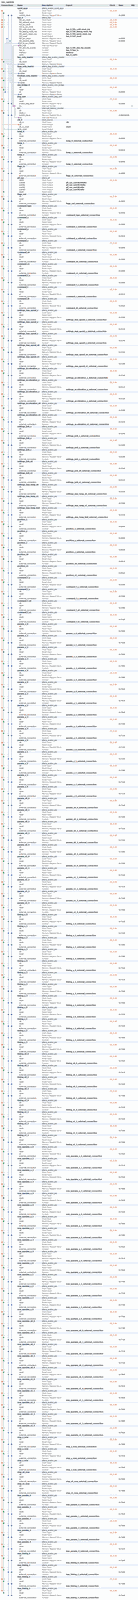
[diagram p0: system contents, whole]
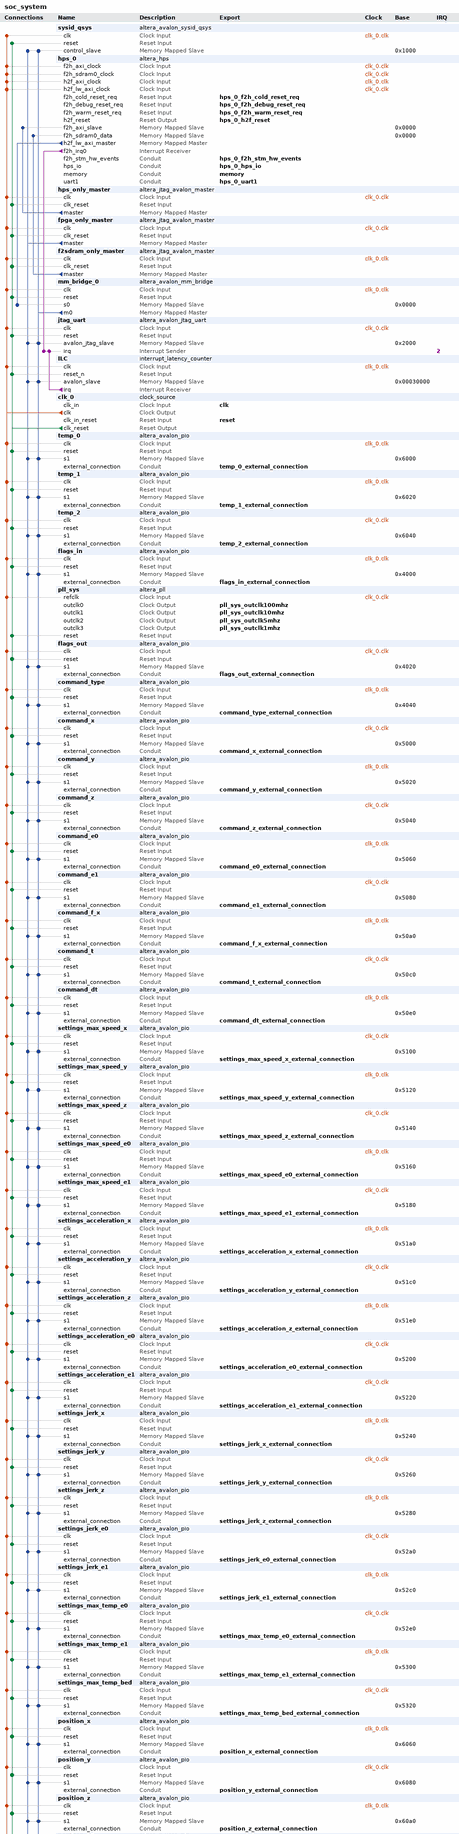
[diagram p1: system contents, upper part]
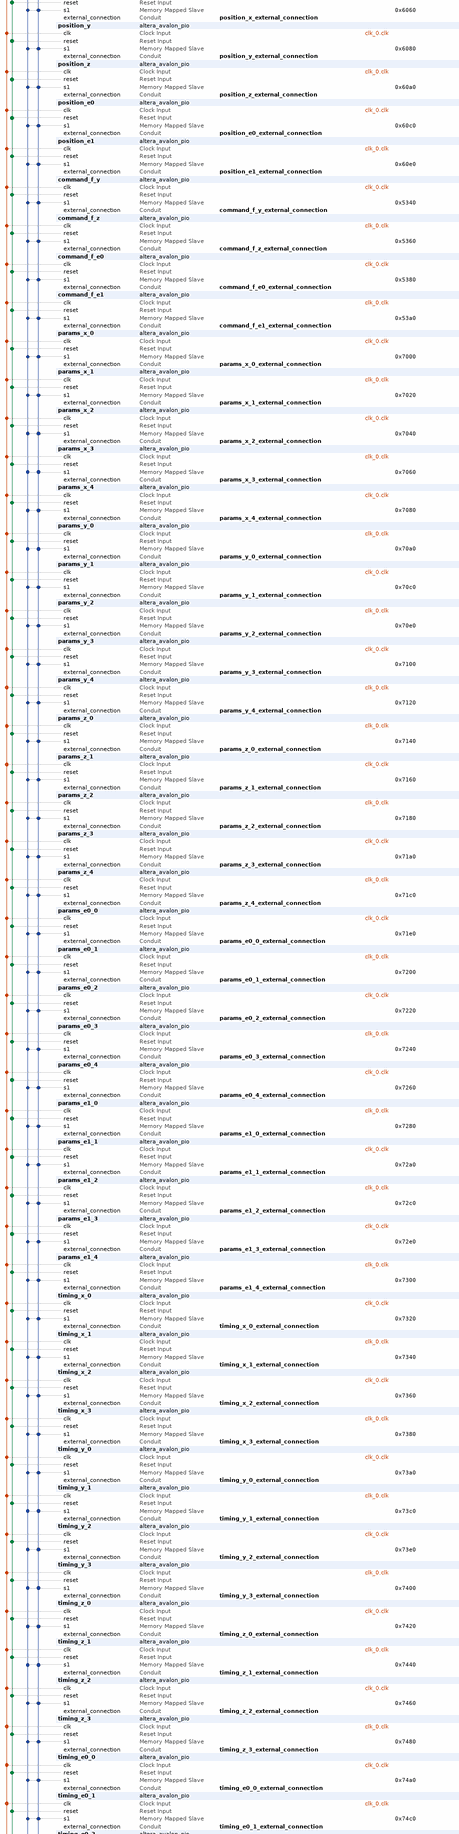
[diagram p2: system contents, middle part]
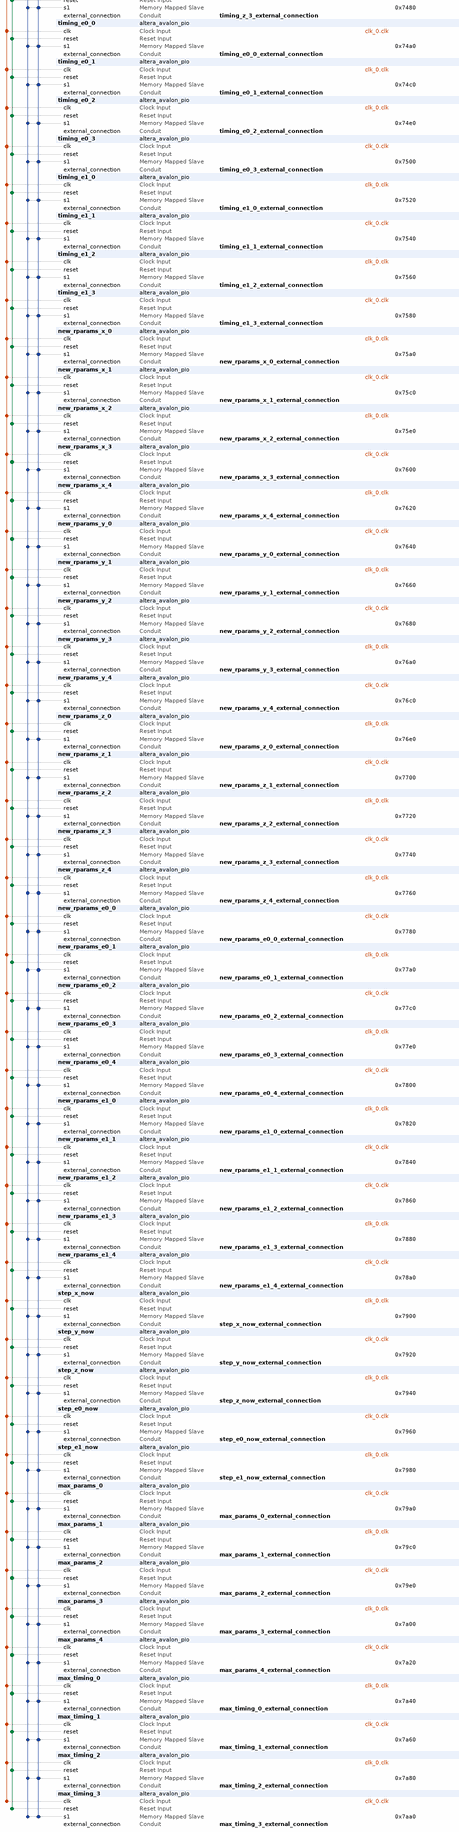
[diagram p3: system contents, lower part]
# Platform Designer (Qsys) system soc_system, Cyclone V 5CSEBA6U23I7
# Parameters at their usual value, and those the tool derives, are not listed.
package require -exact qsys 18.1
create_system soc_system
set_project_property DEVICE_FAMILY {Cyclone V}
set_project_property DEVICE 5CSEBA6U23I7

add_instance sysid_qsys altera_avalon_sysid_qsys 18.1
set_instance_parameter_value sysid_qsys id -60670

add_instance hps_0 altera_hps 18.1
set_instance_parameter_value hps_0 EMAC1_Mode RGMII
set_instance_parameter_value hps_0 EMAC1_PinMuxing {HPS I/O Set 0}
set_instance_parameter_value hps_0 F2SCLK_COLDRST_Enable true
set_instance_parameter_value hps_0 F2SCLK_DBGRST_Enable true
set_instance_parameter_value hps_0 F2SCLK_WARMRST_Enable true
set_instance_parameter_value hps_0 F2SDRAM_Type {Avalon-MM Bidirectional}
set_instance_parameter_value hps_0 F2SDRAM_Width 256
set_instance_parameter_value hps_0 F2SINTERRUPT_Enable true
set_instance_parameter_value hps_0 F2S_Width 2
set_instance_parameter_value hps_0 FPGA_PERIPHERAL_OUTPUT_CLOCK_FREQ_EMAC0_GTX_CLK 100
set_instance_parameter_value hps_0 FPGA_PERIPHERAL_OUTPUT_CLOCK_FREQ_EMAC0_MD_CLK 100.0
set_instance_parameter_value hps_0 FPGA_PERIPHERAL_OUTPUT_CLOCK_FREQ_EMAC1_GTX_CLK 100
set_instance_parameter_value hps_0 FPGA_PERIPHERAL_OUTPUT_CLOCK_FREQ_EMAC1_MD_CLK 100.0
set_instance_parameter_value hps_0 HPS_PROTOCOL DDR3
set_instance_parameter_value hps_0 I2C0_Mode I2C
set_instance_parameter_value hps_0 I2C0_PinMuxing {HPS I/O Set 0}
set_instance_parameter_value hps_0 I2C1_Mode I2C
set_instance_parameter_value hps_0 I2C1_PinMuxing {HPS I/O Set 0}
set_instance_parameter_value hps_0 LWH2F_Enable true
set_instance_parameter_value hps_0 MEM_BANKADDR_WIDTH 3
set_instance_parameter_value hps_0 MEM_CLK_FREQ 400.0
set_instance_parameter_value hps_0 MEM_COL_ADDR_WIDTH 10
set_instance_parameter_value hps_0 MEM_DQ_WIDTH 32
set_instance_parameter_value hps_0 MEM_DRV_STR RZQ/6
set_instance_parameter_value hps_0 MEM_ROW_ADDR_WIDTH 15
set_instance_parameter_value hps_0 MEM_RTT_NOM RZQ/6
set_instance_parameter_value hps_0 MEM_RTT_WR {Dynamic ODT off}
set_instance_parameter_value hps_0 MEM_TCL 7
set_instance_parameter_value hps_0 MEM_TFAW_NS 37.5
set_instance_parameter_value hps_0 MEM_TRAS_NS 35.0
set_instance_parameter_value hps_0 MEM_TRCD_NS 13.75
set_instance_parameter_value hps_0 MEM_TRFC_NS 300.0
set_instance_parameter_value hps_0 MEM_TRP_NS 13.75
set_instance_parameter_value hps_0 MEM_VENDOR Other
set_instance_parameter_value hps_0 MEM_WTCL 7
set_instance_parameter_value hps_0 QSPI_Mode N/A
set_instance_parameter_value hps_0 QSPI_PinMuxing Unused
set_instance_parameter_value hps_0 REF_CLK_FREQ 25.0
set_instance_parameter_value hps_0 S2FCLK_USER2CLK 4
set_instance_parameter_value hps_0 S2F_Width 2
set_instance_parameter_value hps_0 SDIO_Mode {4-bit Data}
set_instance_parameter_value hps_0 SDIO_PinMuxing {HPS I/O Set 0}
set_instance_parameter_value hps_0 SPIM1_Mode {Single Slave Select}
set_instance_parameter_value hps_0 SPIM1_PinMuxing {HPS I/O Set 0}
set_instance_parameter_value hps_0 STM_Enable true
set_instance_parameter_value hps_0 TIMING_BOARD_AC_SKEW 0.02
set_instance_parameter_value hps_0 TIMING_BOARD_AC_TO_CK_SKEW 0.0
set_instance_parameter_value hps_0 TIMING_BOARD_DQ_TO_DQS_SKEW 0.0
set_instance_parameter_value hps_0 TIMING_BOARD_MAX_CK_DELAY 0.6
set_instance_parameter_value hps_0 TIMING_BOARD_MAX_DQS_DELAY 0.6
set_instance_parameter_value hps_0 TIMING_BOARD_SKEW_BETWEEN_DQS 0.02
set_instance_parameter_value hps_0 TIMING_BOARD_SKEW_CKDQS_DIMM_MAX 0.01
set_instance_parameter_value hps_0 TIMING_BOARD_SKEW_CKDQS_DIMM_MIN -0.01
set_instance_parameter_value hps_0 TIMING_BOARD_SKEW_WITHIN_DQS 0.02
set_instance_parameter_value hps_0 TIMING_TDH 125
set_instance_parameter_value hps_0 TIMING_TDQSCK 400
set_instance_parameter_value hps_0 TIMING_TDQSQ 120
set_instance_parameter_value hps_0 TIMING_TDS 50
set_instance_parameter_value hps_0 TIMING_TIH 250
set_instance_parameter_value hps_0 TIMING_TIS 175
set_instance_parameter_value hps_0 TIMING_TQSH 0.38
set_instance_parameter_value hps_0 UART0_Mode {No Flow Control}
set_instance_parameter_value hps_0 UART0_PinMuxing {HPS I/O Set 0}
set_instance_parameter_value hps_0 UART1_Mode Full
set_instance_parameter_value hps_0 UART1_PinMuxing FPGA
set_instance_parameter_value hps_0 USB1_Mode SDR
set_instance_parameter_value hps_0 USB1_PinMuxing {HPS I/O Set 0}
set_instance_parameter_value hps_0 desired_cfg_clk_mhz 100.0
set_instance_parameter_value hps_0 desired_qspi_clk_mhz 370.0

add_instance hps_only_master altera_jtag_avalon_master 18.1

add_instance fpga_only_master altera_jtag_avalon_master 18.1

add_instance f2sdram_only_master altera_jtag_avalon_master 18.1

add_instance mm_bridge_0 altera_avalon_mm_bridge 18.1
set_instance_parameter_value mm_bridge_0 ADDRESS_UNITS SYMBOLS
set_instance_parameter_value mm_bridge_0 ADDRESS_WIDTH 10
set_instance_parameter_value mm_bridge_0 DATA_WIDTH 32
set_instance_parameter_value mm_bridge_0 MAX_PENDING_RESPONSES 4
set_instance_parameter_value mm_bridge_0 USE_AUTO_ADDRESS_WIDTH 1

add_instance jtag_uart altera_avalon_jtag_uart 18.1
set_instance_parameter_value jtag_uart allowMultipleConnections true
set_instance_parameter_value jtag_uart simInteractiveOptions INTERACTIVE_ASCII_OUTPUT

add_instance ILC interrupt_latency_counter 18.1

add_instance clk_0 clock_source 18.1
set_instance_parameter_value clk_0 clockFrequency 50000000

add_instance temp_0 altera_avalon_pio 18.1
set_instance_parameter_value temp_0 direction Input
set_instance_parameter_value temp_0 width 12

add_instance temp_1 altera_avalon_pio 18.1
set_instance_parameter_value temp_1 direction Input
set_instance_parameter_value temp_1 width 12

add_instance temp_2 altera_avalon_pio 18.1
set_instance_parameter_value temp_2 direction Input
set_instance_parameter_value temp_2 width 12

add_instance flags_in altera_avalon_pio 18.1
set_instance_parameter_value flags_in direction Input
set_instance_parameter_value flags_in width 32

add_instance pll_sys altera_pll 18.1
set_instance_parameter_value pll_sys gui_device_speed_grade 2
set_instance_parameter_value pll_sys gui_number_of_clocks 4
set_instance_parameter_value pll_sys gui_operation_mode direct
set_instance_parameter_value pll_sys gui_output_clock_frequency0 100.0
set_instance_parameter_value pll_sys gui_output_clock_frequency1 10.0
set_instance_parameter_value pll_sys gui_output_clock_frequency2 5.0
set_instance_parameter_value pll_sys gui_output_clock_frequency3 1.0
set_instance_parameter_value pll_sys gui_pll_mode {Integer-N PLL}
set_instance_parameter_value pll_sys gui_reference_clock_frequency 50.0
set_instance_parameter_value pll_sys gui_use_locked false

add_instance flags_out altera_avalon_pio 18.1
set_instance_parameter_value flags_out direction Output
set_instance_parameter_value flags_out width 32

add_instance command_type altera_avalon_pio 18.1
set_instance_parameter_value command_type direction Output
set_instance_parameter_value command_type width 32

add_instance command_x altera_avalon_pio 18.1
set_instance_parameter_value command_x direction Output
set_instance_parameter_value command_x width 32

add_instance command_y altera_avalon_pio 18.1
set_instance_parameter_value command_y direction Output
set_instance_parameter_value command_y width 32

add_instance command_z altera_avalon_pio 18.1
set_instance_parameter_value command_z direction Output
set_instance_parameter_value command_z width 32

add_instance command_e0 altera_avalon_pio 18.1
set_instance_parameter_value command_e0 direction Output
set_instance_parameter_value command_e0 width 32

add_instance command_e1 altera_avalon_pio 18.1
set_instance_parameter_value command_e1 direction Output
set_instance_parameter_value command_e1 width 32

add_instance command_f_x altera_avalon_pio 18.1
set_instance_parameter_value command_f_x direction Output
set_instance_parameter_value command_f_x width 32

add_instance command_t altera_avalon_pio 18.1
set_instance_parameter_value command_t direction Output
set_instance_parameter_value command_t width 12

add_instance command_dt altera_avalon_pio 18.1
set_instance_parameter_value command_dt direction Output
set_instance_parameter_value command_dt width 12

add_instance settings_max_speed_x altera_avalon_pio 18.1
set_instance_parameter_value settings_max_speed_x direction Output
set_instance_parameter_value settings_max_speed_x width 32

add_instance settings_max_speed_y altera_avalon_pio 18.1
set_instance_parameter_value settings_max_speed_y direction Output
set_instance_parameter_value settings_max_speed_y width 32

add_instance settings_max_speed_z altera_avalon_pio 18.1
set_instance_parameter_value settings_max_speed_z direction Output
set_instance_parameter_value settings_max_speed_z width 32

add_instance settings_max_speed_e0 altera_avalon_pio 18.1
set_instance_parameter_value settings_max_speed_e0 direction Output
set_instance_parameter_value settings_max_speed_e0 width 32

add_instance settings_max_speed_e1 altera_avalon_pio 18.1
set_instance_parameter_value settings_max_speed_e1 direction Output
set_instance_parameter_value settings_max_speed_e1 width 32

add_instance settings_acceleration_x altera_avalon_pio 18.1
set_instance_parameter_value settings_acceleration_x direction Output
set_instance_parameter_value settings_acceleration_x width 32

add_instance settings_acceleration_y altera_avalon_pio 18.1
set_instance_parameter_value settings_acceleration_y direction Output
set_instance_parameter_value settings_acceleration_y width 32

add_instance settings_acceleration_z altera_avalon_pio 18.1
set_instance_parameter_value settings_acceleration_z direction Output
set_instance_parameter_value settings_acceleration_z width 32

add_instance settings_acceleration_e0 altera_avalon_pio 18.1
set_instance_parameter_value settings_acceleration_e0 direction Output
set_instance_parameter_value settings_acceleration_e0 width 32

add_instance settings_acceleration_e1 altera_avalon_pio 18.1
set_instance_parameter_value settings_acceleration_e1 direction Output
set_instance_parameter_value settings_acceleration_e1 width 32

add_instance settings_jerk_x altera_avalon_pio 18.1
set_instance_parameter_value settings_jerk_x direction Output
set_instance_parameter_value settings_jerk_x width 32

add_instance settings_jerk_y altera_avalon_pio 18.1
set_instance_parameter_value settings_jerk_y direction Output
set_instance_parameter_value settings_jerk_y width 32

add_instance settings_jerk_z altera_avalon_pio 18.1
set_instance_parameter_value settings_jerk_z direction Output
set_instance_parameter_value settings_jerk_z width 32

add_instance settings_jerk_e0 altera_avalon_pio 18.1
set_instance_parameter_value settings_jerk_e0 direction Output
set_instance_parameter_value settings_jerk_e0 width 32

add_instance settings_jerk_e1 altera_avalon_pio 18.1
set_instance_parameter_value settings_jerk_e1 direction Output
set_instance_parameter_value settings_jerk_e1 width 32

add_instance settings_max_temp_e0 altera_avalon_pio 18.1
set_instance_parameter_value settings_max_temp_e0 direction Output
set_instance_parameter_value settings_max_temp_e0 width 12

add_instance settings_max_temp_e1 altera_avalon_pio 18.1
set_instance_parameter_value settings_max_temp_e1 direction Output
set_instance_parameter_value settings_max_temp_e1 width 12

add_instance settings_max_temp_bed altera_avalon_pio 18.1
set_instance_parameter_value settings_max_temp_bed direction Output
set_instance_parameter_value settings_max_temp_bed width 12

add_instance position_x altera_avalon_pio 18.1
set_instance_parameter_value position_x direction Input
set_instance_parameter_value position_x width 32

add_instance position_y altera_avalon_pio 18.1
set_instance_parameter_value position_y direction Input
set_instance_parameter_value position_y width 32

add_instance position_z altera_avalon_pio 18.1
set_instance_parameter_value position_z direction Input
set_instance_parameter_value position_z width 32

add_instance position_e0 altera_avalon_pio 18.1
set_instance_parameter_value position_e0 direction Input
set_instance_parameter_value position_e0 width 32

add_instance position_e1 altera_avalon_pio 18.1
set_instance_parameter_value position_e1 direction Input
set_instance_parameter_value position_e1 width 32

add_instance command_f_y altera_avalon_pio 18.1
set_instance_parameter_value command_f_y direction Output
set_instance_parameter_value command_f_y width 32

add_instance command_f_z altera_avalon_pio 18.1
set_instance_parameter_value command_f_z direction Output
set_instance_parameter_value command_f_z width 32

add_instance command_f_e0 altera_avalon_pio 18.1
set_instance_parameter_value command_f_e0 direction Output
set_instance_parameter_value command_f_e0 width 32

add_instance command_f_e1 altera_avalon_pio 18.1
set_instance_parameter_value command_f_e1 direction Output
set_instance_parameter_value command_f_e1 width 32

add_instance params_x_0 altera_avalon_pio 18.1
set_instance_parameter_value params_x_0 direction Input
set_instance_parameter_value params_x_0 width 32

add_instance params_x_1 altera_avalon_pio 18.1
set_instance_parameter_value params_x_1 direction Input
set_instance_parameter_value params_x_1 width 32

add_instance params_x_2 altera_avalon_pio 18.1
set_instance_parameter_value params_x_2 direction Input
set_instance_parameter_value params_x_2 width 32

add_instance params_x_3 altera_avalon_pio 18.1
set_instance_parameter_value params_x_3 direction Input
set_instance_parameter_value params_x_3 width 32

add_instance params_x_4 altera_avalon_pio 18.1
set_instance_parameter_value params_x_4 direction Input
set_instance_parameter_value params_x_4 width 32

add_instance params_y_0 altera_avalon_pio 18.1
set_instance_parameter_value params_y_0 direction Input
set_instance_parameter_value params_y_0 width 32

add_instance params_y_1 altera_avalon_pio 18.1
set_instance_parameter_value params_y_1 direction Input
set_instance_parameter_value params_y_1 width 32

add_instance params_y_2 altera_avalon_pio 18.1
set_instance_parameter_value params_y_2 direction Input
set_instance_parameter_value params_y_2 width 32

add_instance params_y_3 altera_avalon_pio 18.1
set_instance_parameter_value params_y_3 direction Input
set_instance_parameter_value params_y_3 width 32

add_instance params_y_4 altera_avalon_pio 18.1
set_instance_parameter_value params_y_4 direction Input
set_instance_parameter_value params_y_4 width 32

add_instance params_z_0 altera_avalon_pio 18.1
set_instance_parameter_value params_z_0 direction Input
set_instance_parameter_value params_z_0 width 32

add_instance params_z_1 altera_avalon_pio 18.1
set_instance_parameter_value params_z_1 direction Input
set_instance_parameter_value params_z_1 width 32

add_instance params_z_2 altera_avalon_pio 18.1
set_instance_parameter_value params_z_2 direction Input
set_instance_parameter_value params_z_2 width 32

add_instance params_z_3 altera_avalon_pio 18.1
set_instance_parameter_value params_z_3 direction Input
set_instance_parameter_value params_z_3 width 32

add_instance params_z_4 altera_avalon_pio 18.1
set_instance_parameter_value params_z_4 direction Input
set_instance_parameter_value params_z_4 width 32

add_instance params_e0_0 altera_avalon_pio 18.1
set_instance_parameter_value params_e0_0 direction Input
set_instance_parameter_value params_e0_0 width 32

add_instance params_e0_1 altera_avalon_pio 18.1
set_instance_parameter_value params_e0_1 direction Input
set_instance_parameter_value params_e0_1 width 32

add_instance params_e0_2 altera_avalon_pio 18.1
set_instance_parameter_value params_e0_2 direction Input
set_instance_parameter_value params_e0_2 width 32

add_instance params_e0_3 altera_avalon_pio 18.1
set_instance_parameter_value params_e0_3 direction Input
set_instance_parameter_value params_e0_3 width 32

add_instance params_e0_4 altera_avalon_pio 18.1
set_instance_parameter_value params_e0_4 direction Input
set_instance_parameter_value params_e0_4 width 32

add_instance params_e1_0 altera_avalon_pio 18.1
set_instance_parameter_value params_e1_0 direction Input
set_instance_parameter_value params_e1_0 width 32

add_instance params_e1_1 altera_avalon_pio 18.1
set_instance_parameter_value params_e1_1 direction Input
set_instance_parameter_value params_e1_1 width 32

add_instance params_e1_2 altera_avalon_pio 18.1
set_instance_parameter_value params_e1_2 direction Input
set_instance_parameter_value params_e1_2 width 32

add_instance params_e1_3 altera_avalon_pio 18.1
set_instance_parameter_value params_e1_3 direction Input
set_instance_parameter_value params_e1_3 width 32

add_instance params_e1_4 altera_avalon_pio 18.1
set_instance_parameter_value params_e1_4 direction Input
set_instance_parameter_value params_e1_4 width 32

add_instance timing_x_0 altera_avalon_pio 18.1
set_instance_parameter_value timing_x_0 direction Input
set_instance_parameter_value timing_x_0 width 32

add_instance timing_x_1 altera_avalon_pio 18.1
set_instance_parameter_value timing_x_1 direction Input
set_instance_parameter_value timing_x_1 width 32

add_instance timing_x_2 altera_avalon_pio 18.1
set_instance_parameter_value timing_x_2 direction Input
set_instance_parameter_value timing_x_2 width 32

add_instance timing_x_3 altera_avalon_pio 18.1
set_instance_parameter_value timing_x_3 direction Input
set_instance_parameter_value timing_x_3 width 32

add_instance timing_y_0 altera_avalon_pio 18.1
set_instance_parameter_value timing_y_0 direction Input
set_instance_parameter_value timing_y_0 width 32

add_instance timing_y_1 altera_avalon_pio 18.1
set_instance_parameter_value timing_y_1 direction Input
set_instance_parameter_value timing_y_1 width 32

add_instance timing_y_2 altera_avalon_pio 18.1
set_instance_parameter_value timing_y_2 direction Input
set_instance_parameter_value timing_y_2 width 32

add_instance timing_y_3 altera_avalon_pio 18.1
set_instance_parameter_value timing_y_3 direction Input
set_instance_parameter_value timing_y_3 width 32

add_instance timing_z_0 altera_avalon_pio 18.1
set_instance_parameter_value timing_z_0 direction Input
set_instance_parameter_value timing_z_0 width 32

add_instance timing_z_1 altera_avalon_pio 18.1
set_instance_parameter_value timing_z_1 direction Input
set_instance_parameter_value timing_z_1 width 32

add_instance timing_z_2 altera_avalon_pio 18.1
set_instance_parameter_value timing_z_2 direction Input
set_instance_parameter_value timing_z_2 width 32

add_instance timing_z_3 altera_avalon_pio 18.1
set_instance_parameter_value timing_z_3 direction Input
set_instance_parameter_value timing_z_3 width 32

add_instance timing_e0_0 altera_avalon_pio 18.1
set_instance_parameter_value timing_e0_0 direction Input
set_instance_parameter_value timing_e0_0 width 32

add_instance timing_e0_1 altera_avalon_pio 18.1
set_instance_parameter_value timing_e0_1 direction Input
set_instance_parameter_value timing_e0_1 width 32

add_instance timing_e0_2 altera_avalon_pio 18.1
set_instance_parameter_value timing_e0_2 direction Input
set_instance_parameter_value timing_e0_2 width 32

add_instance timing_e0_3 altera_avalon_pio 18.1
set_instance_parameter_value timing_e0_3 direction Input
set_instance_parameter_value timing_e0_3 width 32

add_instance timing_e1_0 altera_avalon_pio 18.1
set_instance_parameter_value timing_e1_0 direction Input
set_instance_parameter_value timing_e1_0 width 32

add_instance timing_e1_1 altera_avalon_pio 18.1
set_instance_parameter_value timing_e1_1 direction Input
set_instance_parameter_value timing_e1_1 width 32

add_instance timing_e1_2 altera_avalon_pio 18.1
set_instance_parameter_value timing_e1_2 direction Input
set_instance_parameter_value timing_e1_2 width 32

add_instance timing_e1_3 altera_avalon_pio 18.1
set_instance_parameter_value timing_e1_3 direction Input
set_instance_parameter_value timing_e1_3 width 32

add_instance new_rparams_x_0 altera_avalon_pio 18.1
set_instance_parameter_value new_rparams_x_0 direction Input
set_instance_parameter_value new_rparams_x_0 width 32

add_instance new_rparams_x_1 altera_avalon_pio 18.1
set_instance_parameter_value new_rparams_x_1 direction Input
set_instance_parameter_value new_rparams_x_1 width 32

add_instance new_rparams_x_2 altera_avalon_pio 18.1
set_instance_parameter_value new_rparams_x_2 direction Input
set_instance_parameter_value new_rparams_x_2 width 32

add_instance new_rparams_x_3 altera_avalon_pio 18.1
set_instance_parameter_value new_rparams_x_3 direction Input
set_instance_parameter_value new_rparams_x_3 width 32

add_instance new_rparams_x_4 altera_avalon_pio 18.1
set_instance_parameter_value new_rparams_x_4 direction Input
set_instance_parameter_value new_rparams_x_4 width 32

add_instance new_rparams_y_0 altera_avalon_pio 18.1
set_instance_parameter_value new_rparams_y_0 direction Input
set_instance_parameter_value new_rparams_y_0 width 32

add_instance new_rparams_y_1 altera_avalon_pio 18.1
set_instance_parameter_value new_rparams_y_1 direction Input
set_instance_parameter_value new_rparams_y_1 width 32

add_instance new_rparams_y_2 altera_avalon_pio 18.1
set_instance_parameter_value new_rparams_y_2 direction Input
set_instance_parameter_value new_rparams_y_2 width 32

add_instance new_rparams_y_3 altera_avalon_pio 18.1
set_instance_parameter_value new_rparams_y_3 direction Input
set_instance_parameter_value new_rparams_y_3 width 32

add_instance new_rparams_y_4 altera_avalon_pio 18.1
set_instance_parameter_value new_rparams_y_4 direction Input
set_instance_parameter_value new_rparams_y_4 width 32

add_instance new_rparams_z_0 altera_avalon_pio 18.1
set_instance_parameter_value new_rparams_z_0 direction Input
set_instance_parameter_value new_rparams_z_0 width 32

add_instance new_rparams_z_1 altera_avalon_pio 18.1
set_instance_parameter_value new_rparams_z_1 direction Input
set_instance_parameter_value new_rparams_z_1 width 32

add_instance new_rparams_z_2 altera_avalon_pio 18.1
set_instance_parameter_value new_rparams_z_2 direction Input
set_instance_parameter_value new_rparams_z_2 width 32

add_instance new_rparams_z_3 altera_avalon_pio 18.1
set_instance_parameter_value new_rparams_z_3 direction Input
set_instance_parameter_value new_rparams_z_3 width 32

add_instance new_rparams_z_4 altera_avalon_pio 18.1
set_instance_parameter_value new_rparams_z_4 direction Input
set_instance_parameter_value new_rparams_z_4 width 32

add_instance new_rparams_e0_0 altera_avalon_pio 18.1
set_instance_parameter_value new_rparams_e0_0 direction Input
set_instance_parameter_value new_rparams_e0_0 width 32

add_instance new_rparams_e0_1 altera_avalon_pio 18.1
set_instance_parameter_value new_rparams_e0_1 direction Input
set_instance_parameter_value new_rparams_e0_1 width 32

add_instance new_rparams_e0_2 altera_avalon_pio 18.1
set_instance_parameter_value new_rparams_e0_2 direction Input
set_instance_parameter_value new_rparams_e0_2 width 32

add_instance new_rparams_e0_3 altera_avalon_pio 18.1
set_instance_parameter_value new_rparams_e0_3 direction Input
set_instance_parameter_value new_rparams_e0_3 width 32

add_instance new_rparams_e0_4 altera_avalon_pio 18.1
set_instance_parameter_value new_rparams_e0_4 direction Input
set_instance_parameter_value new_rparams_e0_4 width 32

add_instance new_rparams_e1_0 altera_avalon_pio 18.1
set_instance_parameter_value new_rparams_e1_0 direction Input
set_instance_parameter_value new_rparams_e1_0 width 32

add_instance new_rparams_e1_1 altera_avalon_pio 18.1
set_instance_parameter_value new_rparams_e1_1 direction Input
set_instance_parameter_value new_rparams_e1_1 width 32

add_instance new_rparams_e1_2 altera_avalon_pio 18.1
set_instance_parameter_value new_rparams_e1_2 direction Input
set_instance_parameter_value new_rparams_e1_2 width 32

add_instance new_rparams_e1_3 altera_avalon_pio 18.1
set_instance_parameter_value new_rparams_e1_3 direction Input
set_instance_parameter_value new_rparams_e1_3 width 32

add_instance new_rparams_e1_4 altera_avalon_pio 18.1
set_instance_parameter_value new_rparams_e1_4 direction Input
set_instance_parameter_value new_rparams_e1_4 width 32

add_instance step_x_now altera_avalon_pio 18.1
set_instance_parameter_value step_x_now direction Input
set_instance_parameter_value step_x_now width 32

add_instance step_y_now altera_avalon_pio 18.1
set_instance_parameter_value step_y_now direction Input
set_instance_parameter_value step_y_now width 32

add_instance step_z_now altera_avalon_pio 18.1
set_instance_parameter_value step_z_now direction Input
set_instance_parameter_value step_z_now width 32

add_instance step_e0_now altera_avalon_pio 18.1
set_instance_parameter_value step_e0_now direction Input
set_instance_parameter_value step_e0_now width 32

add_instance step_e1_now altera_avalon_pio 18.1
set_instance_parameter_value step_e1_now direction Input
set_instance_parameter_value step_e1_now width 32

add_instance max_params_0 altera_avalon_pio 18.1
set_instance_parameter_value max_params_0 direction Input
set_instance_parameter_value max_params_0 width 32

add_instance max_params_1 altera_avalon_pio 18.1
set_instance_parameter_value max_params_1 direction Input
set_instance_parameter_value max_params_1 width 32

add_instance max_params_2 altera_avalon_pio 18.1
set_instance_parameter_value max_params_2 direction Input
set_instance_parameter_value max_params_2 width 32

add_instance max_params_3 altera_avalon_pio 18.1
set_instance_parameter_value max_params_3 direction Input
set_instance_parameter_value max_params_3 width 32

add_instance max_params_4 altera_avalon_pio 18.1
set_instance_parameter_value max_params_4 direction Input
set_instance_parameter_value max_params_4 width 32

add_instance max_timing_0 altera_avalon_pio 18.1
set_instance_parameter_value max_timing_0 direction Input
set_instance_parameter_value max_timing_0 width 32

add_instance max_timing_1 altera_avalon_pio 18.1
set_instance_parameter_value max_timing_1 direction Input
set_instance_parameter_value max_timing_1 width 32

add_instance max_timing_2 altera_avalon_pio 18.1
set_instance_parameter_value max_timing_2 direction Input
set_instance_parameter_value max_timing_2 width 32

add_instance max_timing_3 altera_avalon_pio 18.1
set_instance_parameter_value max_timing_3 direction Input
set_instance_parameter_value max_timing_3 width 32

# connections
add_connection clk_0.clk command_dt.clk clock
add_connection clk_0.clk command_e0.clk clock
add_connection clk_0.clk command_e1.clk clock
add_connection clk_0.clk command_f_e0.clk clock
add_connection clk_0.clk command_f_e1.clk clock
add_connection clk_0.clk command_f_x.clk clock
add_connection clk_0.clk command_f_y.clk clock
add_connection clk_0.clk command_f_z.clk clock
add_connection clk_0.clk command_t.clk clock
add_connection clk_0.clk command_type.clk clock
add_connection clk_0.clk command_x.clk clock
add_connection clk_0.clk command_y.clk clock
add_connection clk_0.clk command_z.clk clock
add_connection clk_0.clk f2sdram_only_master.clk clock
add_connection clk_0.clk flags_in.clk clock
add_connection clk_0.clk flags_out.clk clock
add_connection clk_0.clk fpga_only_master.clk clock
add_connection clk_0.clk hps_0.f2h_axi_clock clock
add_connection clk_0.clk hps_0.f2h_sdram0_clock clock
add_connection clk_0.clk hps_0.h2f_axi_clock clock
add_connection clk_0.clk hps_0.h2f_lw_axi_clock clock
add_connection clk_0.clk hps_only_master.clk clock
add_connection clk_0.clk ILC.clk clock
add_connection clk_0.clk jtag_uart.clk clock
add_connection clk_0.clk max_params_0.clk clock
add_connection clk_0.clk max_params_1.clk clock
add_connection clk_0.clk max_params_2.clk clock
add_connection clk_0.clk max_params_3.clk clock
add_connection clk_0.clk max_params_4.clk clock
add_connection clk_0.clk max_timing_0.clk clock
add_connection clk_0.clk max_timing_1.clk clock
add_connection clk_0.clk max_timing_2.clk clock
add_connection clk_0.clk max_timing_3.clk clock
add_connection clk_0.clk mm_bridge_0.clk clock
add_connection clk_0.clk new_rparams_e0_0.clk clock
add_connection clk_0.clk new_rparams_e0_1.clk clock
add_connection clk_0.clk new_rparams_e0_2.clk clock
add_connection clk_0.clk new_rparams_e0_3.clk clock
add_connection clk_0.clk new_rparams_e0_4.clk clock
add_connection clk_0.clk new_rparams_e1_0.clk clock
add_connection clk_0.clk new_rparams_e1_1.clk clock
add_connection clk_0.clk new_rparams_e1_2.clk clock
add_connection clk_0.clk new_rparams_e1_3.clk clock
add_connection clk_0.clk new_rparams_e1_4.clk clock
add_connection clk_0.clk new_rparams_x_0.clk clock
add_connection clk_0.clk new_rparams_x_1.clk clock
add_connection clk_0.clk new_rparams_x_2.clk clock
add_connection clk_0.clk new_rparams_x_3.clk clock
add_connection clk_0.clk new_rparams_x_4.clk clock
add_connection clk_0.clk new_rparams_y_0.clk clock
add_connection clk_0.clk new_rparams_y_1.clk clock
add_connection clk_0.clk new_rparams_y_2.clk clock
add_connection clk_0.clk new_rparams_y_3.clk clock
add_connection clk_0.clk new_rparams_y_4.clk clock
add_connection clk_0.clk new_rparams_z_0.clk clock
add_connection clk_0.clk new_rparams_z_1.clk clock
add_connection clk_0.clk new_rparams_z_2.clk clock
add_connection clk_0.clk new_rparams_z_3.clk clock
add_connection clk_0.clk new_rparams_z_4.clk clock
add_connection clk_0.clk params_e0_0.clk clock
add_connection clk_0.clk params_e0_1.clk clock
add_connection clk_0.clk params_e0_2.clk clock
add_connection clk_0.clk params_e0_3.clk clock
add_connection clk_0.clk params_e0_4.clk clock
add_connection clk_0.clk params_e1_0.clk clock
add_connection clk_0.clk params_e1_1.clk clock
add_connection clk_0.clk params_e1_2.clk clock
add_connection clk_0.clk params_e1_3.clk clock
add_connection clk_0.clk params_e1_4.clk clock
add_connection clk_0.clk params_x_0.clk clock
add_connection clk_0.clk params_x_1.clk clock
add_connection clk_0.clk params_x_2.clk clock
add_connection clk_0.clk params_x_3.clk clock
add_connection clk_0.clk params_x_4.clk clock
add_connection clk_0.clk params_y_0.clk clock
add_connection clk_0.clk params_y_1.clk clock
add_connection clk_0.clk params_y_2.clk clock
add_connection clk_0.clk params_y_3.clk clock
add_connection clk_0.clk params_y_4.clk clock
add_connection clk_0.clk params_z_0.clk clock
add_connection clk_0.clk params_z_1.clk clock
add_connection clk_0.clk params_z_2.clk clock
add_connection clk_0.clk params_z_3.clk clock
add_connection clk_0.clk params_z_4.clk clock
add_connection clk_0.clk pll_sys.refclk clock
add_connection clk_0.clk position_e0.clk clock
add_connection clk_0.clk position_e1.clk clock
add_connection clk_0.clk position_x.clk clock
add_connection clk_0.clk position_y.clk clock
add_connection clk_0.clk position_z.clk clock
add_connection clk_0.clk settings_acceleration_e0.clk clock
add_connection clk_0.clk settings_acceleration_e1.clk clock
add_connection clk_0.clk settings_acceleration_x.clk clock
add_connection clk_0.clk settings_acceleration_y.clk clock
add_connection clk_0.clk settings_acceleration_z.clk clock
add_connection clk_0.clk settings_jerk_e0.clk clock
add_connection clk_0.clk settings_jerk_e1.clk clock
add_connection clk_0.clk settings_jerk_x.clk clock
add_connection clk_0.clk settings_jerk_y.clk clock
add_connection clk_0.clk settings_jerk_z.clk clock
add_connection clk_0.clk settings_max_speed_e0.clk clock
add_connection clk_0.clk settings_max_speed_e1.clk clock
add_connection clk_0.clk settings_max_speed_x.clk clock
add_connection clk_0.clk settings_max_speed_y.clk clock
add_connection clk_0.clk settings_max_speed_z.clk clock
add_connection clk_0.clk settings_max_temp_bed.clk clock
add_connection clk_0.clk settings_max_temp_e0.clk clock
add_connection clk_0.clk settings_max_temp_e1.clk clock
add_connection clk_0.clk step_e0_now.clk clock
add_connection clk_0.clk step_e1_now.clk clock
add_connection clk_0.clk step_x_now.clk clock
add_connection clk_0.clk step_y_now.clk clock
add_connection clk_0.clk step_z_now.clk clock
add_connection clk_0.clk sysid_qsys.clk clock
add_connection clk_0.clk temp_0.clk clock
add_connection clk_0.clk temp_1.clk clock
add_connection clk_0.clk temp_2.clk clock
add_connection clk_0.clk timing_e0_0.clk clock
add_connection clk_0.clk timing_e0_1.clk clock
add_connection clk_0.clk timing_e0_2.clk clock
add_connection clk_0.clk timing_e0_3.clk clock
add_connection clk_0.clk timing_e1_0.clk clock
add_connection clk_0.clk timing_e1_1.clk clock
add_connection clk_0.clk timing_e1_2.clk clock
add_connection clk_0.clk timing_e1_3.clk clock
add_connection clk_0.clk timing_x_0.clk clock
add_connection clk_0.clk timing_x_1.clk clock
add_connection clk_0.clk timing_x_2.clk clock
add_connection clk_0.clk timing_x_3.clk clock
add_connection clk_0.clk timing_y_0.clk clock
add_connection clk_0.clk timing_y_1.clk clock
add_connection clk_0.clk timing_y_2.clk clock
add_connection clk_0.clk timing_y_3.clk clock
add_connection clk_0.clk timing_z_0.clk clock
add_connection clk_0.clk timing_z_1.clk clock
add_connection clk_0.clk timing_z_2.clk clock
add_connection clk_0.clk timing_z_3.clk clock
add_connection clk_0.clk_reset command_dt.reset reset
add_connection clk_0.clk_reset command_e0.reset reset
add_connection clk_0.clk_reset command_e1.reset reset
add_connection clk_0.clk_reset command_f_e0.reset reset
add_connection clk_0.clk_reset command_f_e1.reset reset
add_connection clk_0.clk_reset command_f_x.reset reset
add_connection clk_0.clk_reset command_f_y.reset reset
add_connection clk_0.clk_reset command_f_z.reset reset
add_connection clk_0.clk_reset command_t.reset reset
add_connection clk_0.clk_reset command_type.reset reset
add_connection clk_0.clk_reset command_x.reset reset
add_connection clk_0.clk_reset command_y.reset reset
add_connection clk_0.clk_reset command_z.reset reset
add_connection clk_0.clk_reset f2sdram_only_master.clk_reset reset
add_connection clk_0.clk_reset flags_in.reset reset
add_connection clk_0.clk_reset flags_out.reset reset
add_connection clk_0.clk_reset fpga_only_master.clk_reset reset
add_connection clk_0.clk_reset hps_only_master.clk_reset reset
add_connection clk_0.clk_reset ILC.reset_n reset
add_connection clk_0.clk_reset jtag_uart.reset reset
add_connection clk_0.clk_reset max_params_0.reset reset
add_connection clk_0.clk_reset max_params_1.reset reset
add_connection clk_0.clk_reset max_params_2.reset reset
add_connection clk_0.clk_reset max_params_3.reset reset
add_connection clk_0.clk_reset max_params_4.reset reset
add_connection clk_0.clk_reset max_timing_0.reset reset
add_connection clk_0.clk_reset max_timing_1.reset reset
add_connection clk_0.clk_reset max_timing_2.reset reset
add_connection clk_0.clk_reset max_timing_3.reset reset
add_connection clk_0.clk_reset mm_bridge_0.reset reset
add_connection clk_0.clk_reset new_rparams_e0_0.reset reset
add_connection clk_0.clk_reset new_rparams_e0_1.reset reset
add_connection clk_0.clk_reset new_rparams_e0_2.reset reset
add_connection clk_0.clk_reset new_rparams_e0_3.reset reset
add_connection clk_0.clk_reset new_rparams_e0_4.reset reset
add_connection clk_0.clk_reset new_rparams_e1_0.reset reset
add_connection clk_0.clk_reset new_rparams_e1_1.reset reset
add_connection clk_0.clk_reset new_rparams_e1_2.reset reset
add_connection clk_0.clk_reset new_rparams_e1_3.reset reset
add_connection clk_0.clk_reset new_rparams_e1_4.reset reset
add_connection clk_0.clk_reset new_rparams_x_0.reset reset
add_connection clk_0.clk_reset new_rparams_x_1.reset reset
add_connection clk_0.clk_reset new_rparams_x_2.reset reset
add_connection clk_0.clk_reset new_rparams_x_3.reset reset
add_connection clk_0.clk_reset new_rparams_x_4.reset reset
add_connection clk_0.clk_reset new_rparams_y_0.reset reset
add_connection clk_0.clk_reset new_rparams_y_1.reset reset
add_connection clk_0.clk_reset new_rparams_y_2.reset reset
add_connection clk_0.clk_reset new_rparams_y_3.reset reset
add_connection clk_0.clk_reset new_rparams_y_4.reset reset
add_connection clk_0.clk_reset new_rparams_z_0.reset reset
add_connection clk_0.clk_reset new_rparams_z_1.reset reset
add_connection clk_0.clk_reset new_rparams_z_2.reset reset
add_connection clk_0.clk_reset new_rparams_z_3.reset reset
add_connection clk_0.clk_reset new_rparams_z_4.reset reset
add_connection clk_0.clk_reset params_e0_0.reset reset
add_connection clk_0.clk_reset params_e0_1.reset reset
add_connection clk_0.clk_reset params_e0_2.reset reset
add_connection clk_0.clk_reset params_e0_3.reset reset
add_connection clk_0.clk_reset params_e0_4.reset reset
add_connection clk_0.clk_reset params_e1_0.reset reset
add_connection clk_0.clk_reset params_e1_1.reset reset
add_connection clk_0.clk_reset params_e1_2.reset reset
add_connection clk_0.clk_reset params_e1_3.reset reset
add_connection clk_0.clk_reset params_e1_4.reset reset
add_connection clk_0.clk_reset params_x_0.reset reset
add_connection clk_0.clk_reset params_x_1.reset reset
add_connection clk_0.clk_reset params_x_2.reset reset
add_connection clk_0.clk_reset params_x_3.reset reset
add_connection clk_0.clk_reset params_x_4.reset reset
add_connection clk_0.clk_reset params_y_0.reset reset
add_connection clk_0.clk_reset params_y_1.reset reset
add_connection clk_0.clk_reset params_y_2.reset reset
add_connection clk_0.clk_reset params_y_3.reset reset
add_connection clk_0.clk_reset params_y_4.reset reset
add_connection clk_0.clk_reset params_z_0.reset reset
add_connection clk_0.clk_reset params_z_1.reset reset
add_connection clk_0.clk_reset params_z_2.reset reset
add_connection clk_0.clk_reset params_z_3.reset reset
add_connection clk_0.clk_reset params_z_4.reset reset
add_connection clk_0.clk_reset pll_sys.reset reset
add_connection clk_0.clk_reset position_e0.reset reset
add_connection clk_0.clk_reset position_e1.reset reset
add_connection clk_0.clk_reset position_x.reset reset
add_connection clk_0.clk_reset position_y.reset reset
add_connection clk_0.clk_reset position_z.reset reset
add_connection clk_0.clk_reset settings_acceleration_e0.reset reset
add_connection clk_0.clk_reset settings_acceleration_e1.reset reset
add_connection clk_0.clk_reset settings_acceleration_x.reset reset
add_connection clk_0.clk_reset settings_acceleration_y.reset reset
add_connection clk_0.clk_reset settings_acceleration_z.reset reset
add_connection clk_0.clk_reset settings_jerk_e0.reset reset
add_connection clk_0.clk_reset settings_jerk_e1.reset reset
add_connection clk_0.clk_reset settings_jerk_x.reset reset
add_connection clk_0.clk_reset settings_jerk_y.reset reset
add_connection clk_0.clk_reset settings_jerk_z.reset reset
add_connection clk_0.clk_reset settings_max_speed_e0.reset reset
add_connection clk_0.clk_reset settings_max_speed_e1.reset reset
add_connection clk_0.clk_reset settings_max_speed_x.reset reset
add_connection clk_0.clk_reset settings_max_speed_y.reset reset
add_connection clk_0.clk_reset settings_max_speed_z.reset reset
add_connection clk_0.clk_reset settings_max_temp_bed.reset reset
add_connection clk_0.clk_reset settings_max_temp_e0.reset reset
add_connection clk_0.clk_reset settings_max_temp_e1.reset reset
add_connection clk_0.clk_reset step_e0_now.reset reset
add_connection clk_0.clk_reset step_e1_now.reset reset
add_connection clk_0.clk_reset step_x_now.reset reset
add_connection clk_0.clk_reset step_y_now.reset reset
add_connection clk_0.clk_reset step_z_now.reset reset
add_connection clk_0.clk_reset sysid_qsys.reset reset
add_connection clk_0.clk_reset temp_0.reset reset
add_connection clk_0.clk_reset temp_1.reset reset
add_connection clk_0.clk_reset temp_2.reset reset
add_connection clk_0.clk_reset timing_e0_0.reset reset
add_connection clk_0.clk_reset timing_e0_1.reset reset
add_connection clk_0.clk_reset timing_e0_2.reset reset
add_connection clk_0.clk_reset timing_e0_3.reset reset
add_connection clk_0.clk_reset timing_e1_0.reset reset
add_connection clk_0.clk_reset timing_e1_1.reset reset
add_connection clk_0.clk_reset timing_e1_2.reset reset
add_connection clk_0.clk_reset timing_e1_3.reset reset
add_connection clk_0.clk_reset timing_x_0.reset reset
add_connection clk_0.clk_reset timing_x_1.reset reset
add_connection clk_0.clk_reset timing_x_2.reset reset
add_connection clk_0.clk_reset timing_x_3.reset reset
add_connection clk_0.clk_reset timing_y_0.reset reset
add_connection clk_0.clk_reset timing_y_1.reset reset
add_connection clk_0.clk_reset timing_y_2.reset reset
add_connection clk_0.clk_reset timing_y_3.reset reset
add_connection clk_0.clk_reset timing_z_0.reset reset
add_connection clk_0.clk_reset timing_z_1.reset reset
add_connection clk_0.clk_reset timing_z_2.reset reset
add_connection clk_0.clk_reset timing_z_3.reset reset
add_connection f2sdram_only_master.master hps_0.f2h_sdram0_data avalon
set_connection_parameter_value f2sdram_only_master.master/hps_0.f2h_sdram0_data baseAddress 0x0000
add_connection fpga_only_master.master command_dt.s1 avalon
set_connection_parameter_value fpga_only_master.master/command_dt.s1 baseAddress 0x50e0
add_connection fpga_only_master.master command_e0.s1 avalon
set_connection_parameter_value fpga_only_master.master/command_e0.s1 baseAddress 0x5060
add_connection fpga_only_master.master command_e1.s1 avalon
set_connection_parameter_value fpga_only_master.master/command_e1.s1 baseAddress 0x5080
add_connection fpga_only_master.master command_f_e0.s1 avalon
set_connection_parameter_value fpga_only_master.master/command_f_e0.s1 baseAddress 0x5380
add_connection fpga_only_master.master command_f_e1.s1 avalon
set_connection_parameter_value fpga_only_master.master/command_f_e1.s1 baseAddress 0x53a0
add_connection fpga_only_master.master command_f_x.s1 avalon
set_connection_parameter_value fpga_only_master.master/command_f_x.s1 baseAddress 0x50a0
add_connection fpga_only_master.master command_f_y.s1 avalon
set_connection_parameter_value fpga_only_master.master/command_f_y.s1 baseAddress 0x5340
add_connection fpga_only_master.master command_f_z.s1 avalon
set_connection_parameter_value fpga_only_master.master/command_f_z.s1 baseAddress 0x5360
add_connection fpga_only_master.master command_t.s1 avalon
set_connection_parameter_value fpga_only_master.master/command_t.s1 baseAddress 0x50c0
add_connection fpga_only_master.master command_type.s1 avalon
set_connection_parameter_value fpga_only_master.master/command_type.s1 baseAddress 0x4040
add_connection fpga_only_master.master command_x.s1 avalon
set_connection_parameter_value fpga_only_master.master/command_x.s1 baseAddress 0x5000
add_connection fpga_only_master.master command_y.s1 avalon
set_connection_parameter_value fpga_only_master.master/command_y.s1 baseAddress 0x5020
add_connection fpga_only_master.master command_z.s1 avalon
set_connection_parameter_value fpga_only_master.master/command_z.s1 baseAddress 0x5040
add_connection fpga_only_master.master flags_in.s1 avalon
set_connection_parameter_value fpga_only_master.master/flags_in.s1 baseAddress 0x4000
add_connection fpga_only_master.master flags_out.s1 avalon
set_connection_parameter_value fpga_only_master.master/flags_out.s1 baseAddress 0x4020
add_connection fpga_only_master.master ILC.avalon_slave avalon
set_connection_parameter_value fpga_only_master.master/ILC.avalon_slave baseAddress 0x00030000
add_connection fpga_only_master.master jtag_uart.avalon_jtag_slave avalon
set_connection_parameter_value fpga_only_master.master/jtag_uart.avalon_jtag_slave baseAddress 0x2000
add_connection fpga_only_master.master max_params_0.s1 avalon
set_connection_parameter_value fpga_only_master.master/max_params_0.s1 baseAddress 0x79a0
add_connection fpga_only_master.master max_params_1.s1 avalon
set_connection_parameter_value fpga_only_master.master/max_params_1.s1 baseAddress 0x79c0
add_connection fpga_only_master.master max_params_2.s1 avalon
set_connection_parameter_value fpga_only_master.master/max_params_2.s1 baseAddress 0x79e0
add_connection fpga_only_master.master max_params_3.s1 avalon
set_connection_parameter_value fpga_only_master.master/max_params_3.s1 baseAddress 0x7a00
add_connection fpga_only_master.master max_params_4.s1 avalon
set_connection_parameter_value fpga_only_master.master/max_params_4.s1 baseAddress 0x7a20
add_connection fpga_only_master.master max_timing_0.s1 avalon
set_connection_parameter_value fpga_only_master.master/max_timing_0.s1 baseAddress 0x7a40
add_connection fpga_only_master.master max_timing_1.s1 avalon
set_connection_parameter_value fpga_only_master.master/max_timing_1.s1 baseAddress 0x7a60
add_connection fpga_only_master.master max_timing_2.s1 avalon
set_connection_parameter_value fpga_only_master.master/max_timing_2.s1 baseAddress 0x7a80
add_connection fpga_only_master.master max_timing_3.s1 avalon
set_connection_parameter_value fpga_only_master.master/max_timing_3.s1 baseAddress 0x7aa0
add_connection fpga_only_master.master new_rparams_e0_0.s1 avalon
set_connection_parameter_value fpga_only_master.master/new_rparams_e0_0.s1 baseAddress 0x7780
add_connection fpga_only_master.master new_rparams_e0_1.s1 avalon
set_connection_parameter_value fpga_only_master.master/new_rparams_e0_1.s1 baseAddress 0x77a0
add_connection fpga_only_master.master new_rparams_e0_2.s1 avalon
set_connection_parameter_value fpga_only_master.master/new_rparams_e0_2.s1 baseAddress 0x77c0
add_connection fpga_only_master.master new_rparams_e0_3.s1 avalon
set_connection_parameter_value fpga_only_master.master/new_rparams_e0_3.s1 baseAddress 0x77e0
add_connection fpga_only_master.master new_rparams_e0_4.s1 avalon
set_connection_parameter_value fpga_only_master.master/new_rparams_e0_4.s1 baseAddress 0x7800
add_connection fpga_only_master.master new_rparams_e1_0.s1 avalon
set_connection_parameter_value fpga_only_master.master/new_rparams_e1_0.s1 baseAddress 0x7820
add_connection fpga_only_master.master new_rparams_e1_1.s1 avalon
set_connection_parameter_value fpga_only_master.master/new_rparams_e1_1.s1 baseAddress 0x7840
add_connection fpga_only_master.master new_rparams_e1_2.s1 avalon
set_connection_parameter_value fpga_only_master.master/new_rparams_e1_2.s1 baseAddress 0x7860
add_connection fpga_only_master.master new_rparams_e1_3.s1 avalon
set_connection_parameter_value fpga_only_master.master/new_rparams_e1_3.s1 baseAddress 0x7880
add_connection fpga_only_master.master new_rparams_e1_4.s1 avalon
set_connection_parameter_value fpga_only_master.master/new_rparams_e1_4.s1 baseAddress 0x78a0
add_connection fpga_only_master.master new_rparams_x_0.s1 avalon
set_connection_parameter_value fpga_only_master.master/new_rparams_x_0.s1 baseAddress 0x75a0
add_connection fpga_only_master.master new_rparams_x_1.s1 avalon
set_connection_parameter_value fpga_only_master.master/new_rparams_x_1.s1 baseAddress 0x75c0
add_connection fpga_only_master.master new_rparams_x_2.s1 avalon
set_connection_parameter_value fpga_only_master.master/new_rparams_x_2.s1 baseAddress 0x75e0
add_connection fpga_only_master.master new_rparams_x_3.s1 avalon
set_connection_parameter_value fpga_only_master.master/new_rparams_x_3.s1 baseAddress 0x7600
add_connection fpga_only_master.master new_rparams_x_4.s1 avalon
set_connection_parameter_value fpga_only_master.master/new_rparams_x_4.s1 baseAddress 0x7620
add_connection fpga_only_master.master new_rparams_y_0.s1 avalon
set_connection_parameter_value fpga_only_master.master/new_rparams_y_0.s1 baseAddress 0x7640
add_connection fpga_only_master.master new_rparams_y_1.s1 avalon
set_connection_parameter_value fpga_only_master.master/new_rparams_y_1.s1 baseAddress 0x7660
add_connection fpga_only_master.master new_rparams_y_2.s1 avalon
set_connection_parameter_value fpga_only_master.master/new_rparams_y_2.s1 baseAddress 0x7680
add_connection fpga_only_master.master new_rparams_y_3.s1 avalon
set_connection_parameter_value fpga_only_master.master/new_rparams_y_3.s1 baseAddress 0x76a0
add_connection fpga_only_master.master new_rparams_y_4.s1 avalon
set_connection_parameter_value fpga_only_master.master/new_rparams_y_4.s1 baseAddress 0x76c0
add_connection fpga_only_master.master new_rparams_z_0.s1 avalon
set_connection_parameter_value fpga_only_master.master/new_rparams_z_0.s1 baseAddress 0x76e0
add_connection fpga_only_master.master new_rparams_z_1.s1 avalon
set_connection_parameter_value fpga_only_master.master/new_rparams_z_1.s1 baseAddress 0x7700
add_connection fpga_only_master.master new_rparams_z_2.s1 avalon
set_connection_parameter_value fpga_only_master.master/new_rparams_z_2.s1 baseAddress 0x7720
add_connection fpga_only_master.master new_rparams_z_3.s1 avalon
set_connection_parameter_value fpga_only_master.master/new_rparams_z_3.s1 baseAddress 0x7740
add_connection fpga_only_master.master new_rparams_z_4.s1 avalon
set_connection_parameter_value fpga_only_master.master/new_rparams_z_4.s1 baseAddress 0x7760
add_connection fpga_only_master.master params_e0_0.s1 avalon
set_connection_parameter_value fpga_only_master.master/params_e0_0.s1 baseAddress 0x71e0
add_connection fpga_only_master.master params_e0_1.s1 avalon
set_connection_parameter_value fpga_only_master.master/params_e0_1.s1 baseAddress 0x7200
add_connection fpga_only_master.master params_e0_2.s1 avalon
set_connection_parameter_value fpga_only_master.master/params_e0_2.s1 baseAddress 0x7220
add_connection fpga_only_master.master params_e0_3.s1 avalon
set_connection_parameter_value fpga_only_master.master/params_e0_3.s1 baseAddress 0x7240
add_connection fpga_only_master.master params_e0_4.s1 avalon
set_connection_parameter_value fpga_only_master.master/params_e0_4.s1 baseAddress 0x7260
add_connection fpga_only_master.master params_e1_0.s1 avalon
set_connection_parameter_value fpga_only_master.master/params_e1_0.s1 baseAddress 0x7280
